# EAGLE design m201-stereo-input (EAGLE 7.5.1)
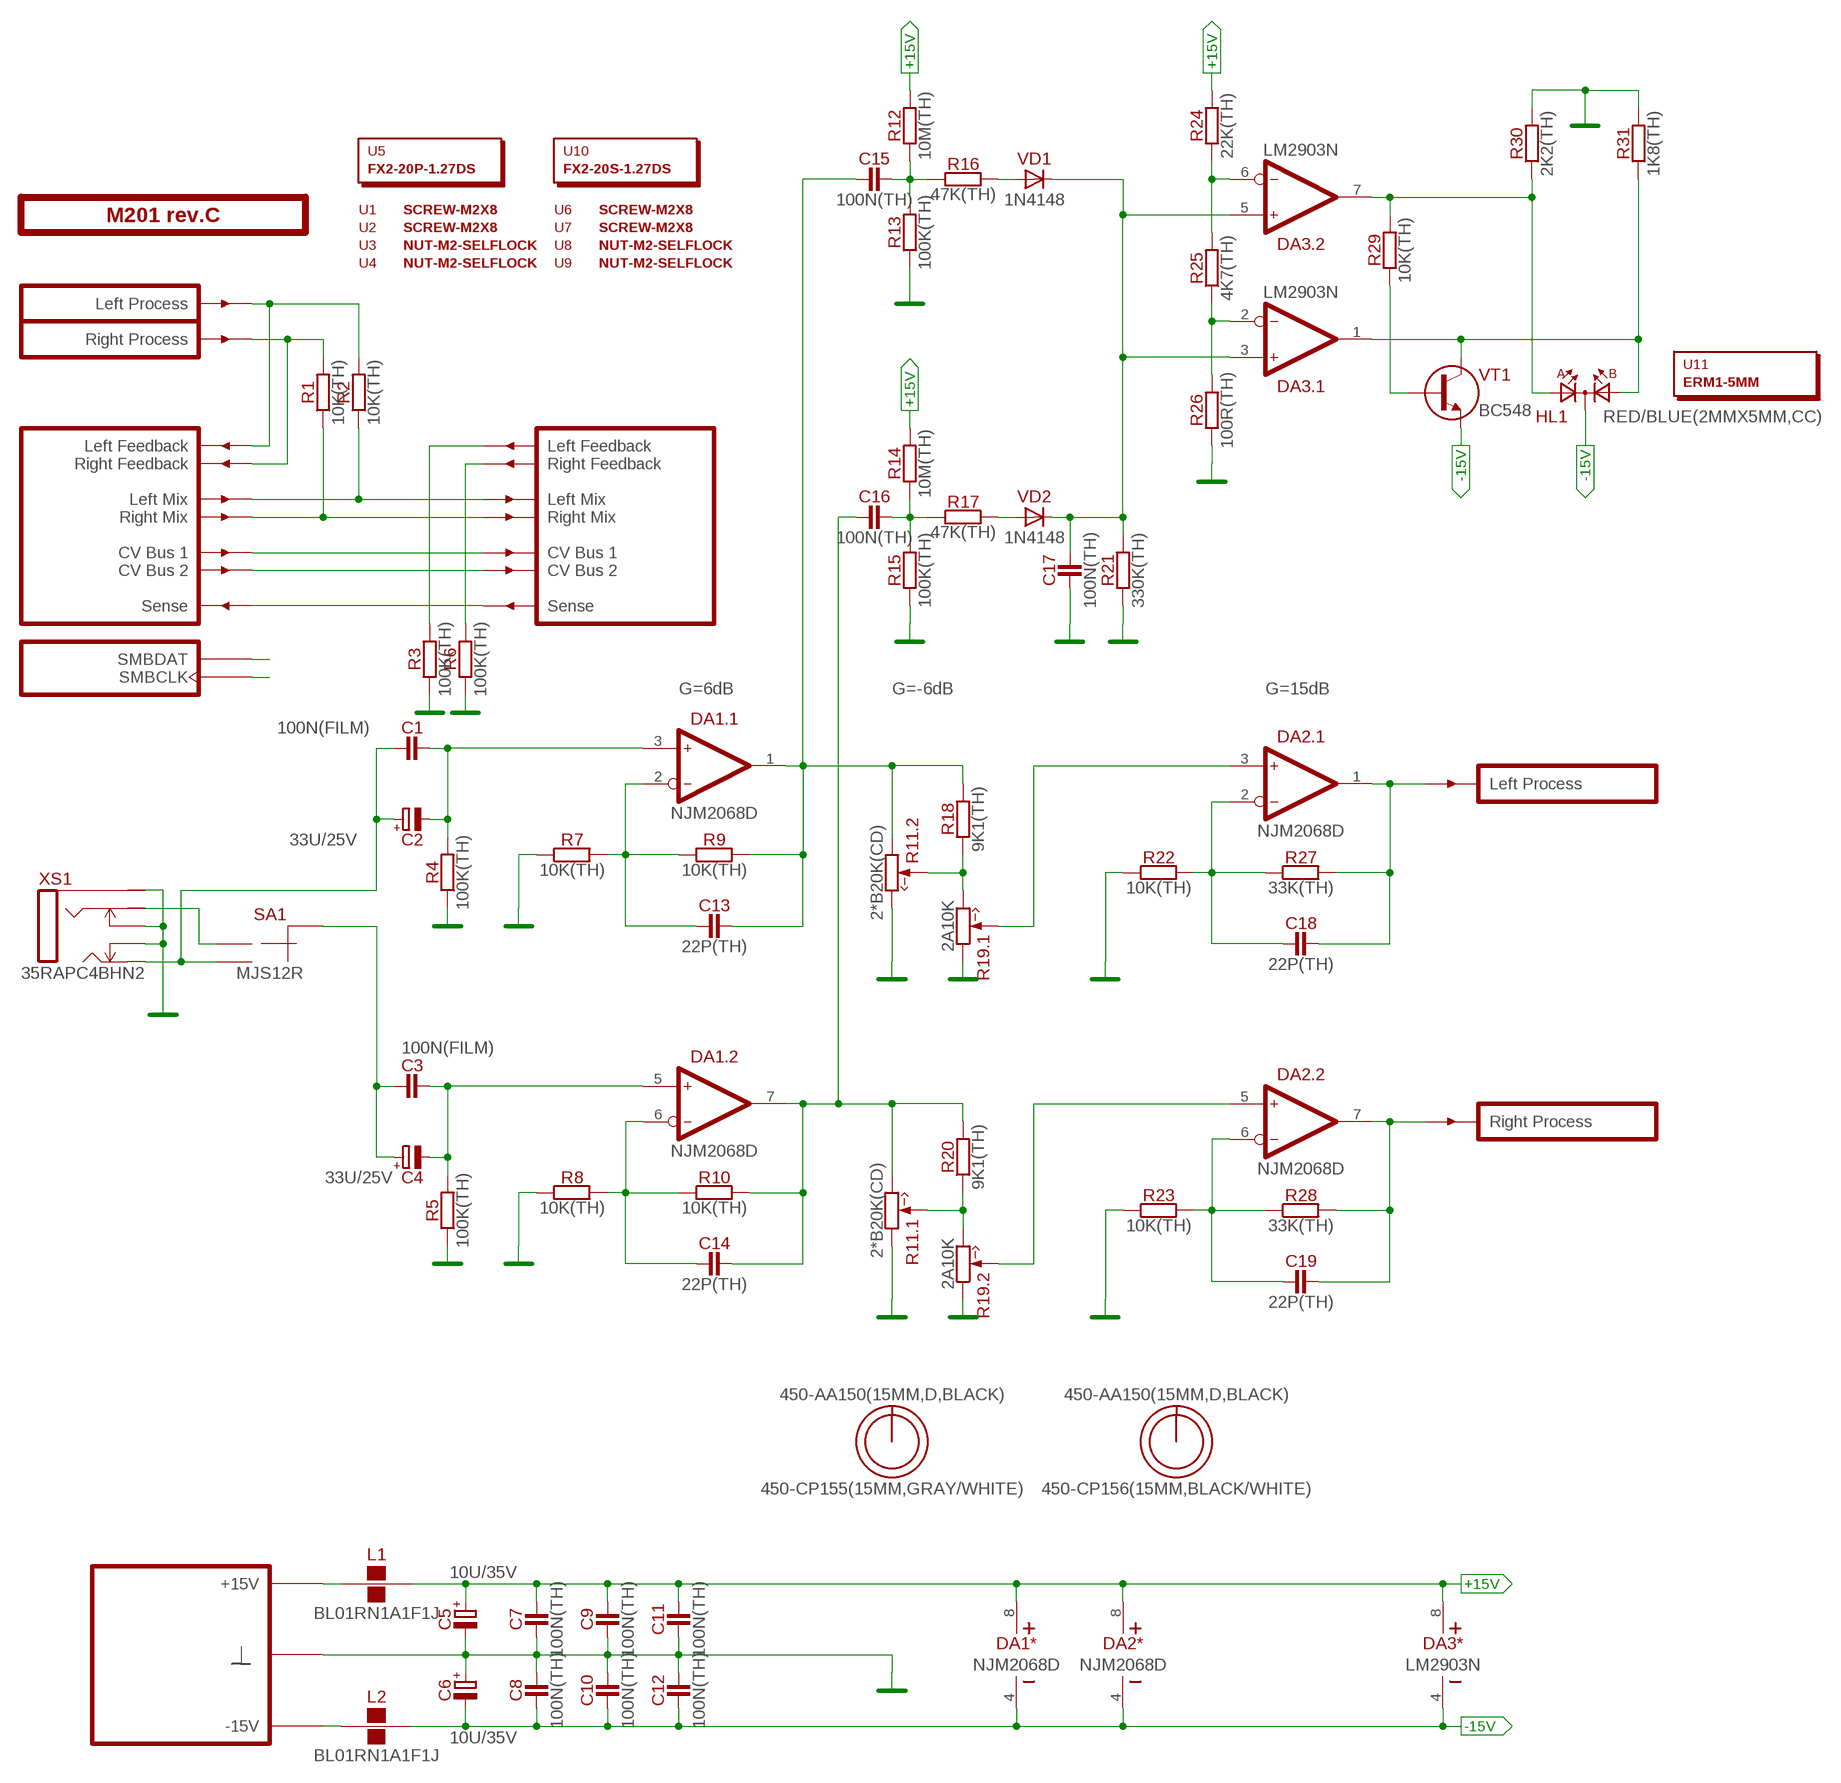
[diagram p0: schematic, sheet 1]

## Parts
C1  100N(FILM)  [C050-025X075]
C2  33U/25V  [E2,5-7]
C3  100N(FILM)  [C050-025X075]
C4  33U/25V  [E2,5-7]
C5  10U/35V  [E2-5]
C6  10U/35V  [E2-5]
C7  100N(TH)  [C050-024X044]
C8  100N(TH)  [C050-024X044]
C9  100N(TH)  [C050-024X044]
C10  100N(TH)  [C050-024X044]
C11  100N(TH)  [C050-024X044]
C12  100N(TH)  [C050-024X044]
C13  22P(TH)  [C050-024X044]
C14  22P(TH)  [C050-024X044]
C15  100N(TH)  [C050-024X044]
C16  100N(TH)  [C050-024X044]
C17  100N(TH)  [C050-024X044]
C18  22P(TH)  [C050-024X044]
C19  22P(TH)  [C050-024X044]
DA1  NJM2068D  [DIP-8]
DA2  NJM2068D  [DIP-8]
DA3  LM2903N  [DIP-8]
HL1  RED/BLUE(2MMX5MM,CC)  [LED2X5-3PIN]
L1  BL01RN1A1F1J  [BL01RN1A]
L2  BL01RN1A1F1J  [BL01RN1A]
O1  450-AA150(15MM,D,BLACK)  [EMPTY]
O2  450-CP155(15MM,GRAY/WHITE)  [EMPTY]
O3  450-AA150(15MM,D,BLACK)  [EMPTY]
O4  450-CP156(15MM,BLACK/WHITE)  [EMPTY]
PCB1  M201 rev.C  ST2-BOARD-50  [ST2-BOARD-50]
R1  10K(TH)  [R-0207/10]
R2  10K(TH)  [R-0207/10]
R3  100K(TH)  [R-0207/10]
R4  100K(TH)  [R-0207/10]
R5  100K(TH)  [R-0207/10]
R6  100K(TH)  [R-0207/10]
R7  10K(TH)  [R-0207/10]
R8  10K(TH)  [R-0207/10]
R9  10K(TH)  [R-0207/10]
R10  10K(TH)  [R-0207/10]
R11  2*B20K(CD)  2B20K(CD)  [RV11-DUAL]
R12  10M(TH)  [R-0207/10]
R13  100K(TH)  [R-0207/10]
R14  10M(TH)  [R-0207/10]
R15  100K(TH)  [R-0207/10]
R16  47K(TH)  [R-0207/10]
R17  47K(TH)  [R-0207/10]
R18  9K1(TH)  [R-0207/10]
R19  2A10K  [RV11-DUAL]
R20  9K1(TH)  [R-0207/10]
R21  330K(TH)  [R-0207/10]
R22  10K(TH)  [R-0207/10]
R23  10K(TH)  [R-0207/10]
R24  22K(TH)  [R-0207/10]
R25  4K7(TH)  [R-0207/10]
R26  100R(TH)  [R-0207/10]
R27  33K(TH)  [R-0207/10]
R28  33K(TH)  [R-0207/10]
R29  10K(TH)  [R-0207/10]
R30  2K2(TH)  [R-0207/10]
R31  1K8(TH)  [R-0207/10]
SA1  MJS12R  [APEM-MJS12R]
U1  SCREW-M2X8  [EMPTY]
U2  SCREW-M2X8  [EMPTY]
U3  NUT-M2-SELFLOCK  [EMPTY]
U4  NUT-M2-SELFLOCK  [EMPTY]
U5  FX2-20P-1.27DS  [EMPTY]
U6  SCREW-M2X8  [EMPTY]
U7  SCREW-M2X8  [EMPTY]
U8  NUT-M2-SELFLOCK  [EMPTY]
U9  NUT-M2-SELFLOCK  [EMPTY]
U10  FX2-20S-1.27DS  [EMPTY]
U11  ERM1-5MM  [EMPTY]
VD1  1N4148  [DO35-7]
VD2  1N4148  [DO35-7]
VT1  BC548  [TO92]
XS1  35RAPC4BHN2  [35RAP]

## Nets
+15V [power]: C5.+ C7.2 C9.2 C11.2 DA1.8(*:V+) DA2.8(*:V+) DA3.8(*:V+) L1.2 R12.2 R14.2 R24.2
-15V: C6.- C8.1 C10.1 C12.1 DA1.4(*:V-) DA2.4(*:V-) DA3.4(*:V-) HL1.K L2.2 VT1.3(E)
GND: C5.- C6.+ C7.1 C8.2 C9.1 C10.2 C11.1 C12.2 C17.1 PCB1.B4'(GND) PCB1.B4(GND) PCB1.B5'(GND) PCB1.B5(GND) PCB1.B6'(GND) PCB1.B6(GND) PCB1.B7'(GND) PCB1.B7(GND) PCB1.B8'(GND) PCB1.B8(GND) R3.1 R4.1 R5.1 R6.1 R7.1 R8.1 R11.1(.1:CCW) R11.3'(.2:CW) R13.1 R15.1 R19.1'(.2:CCW) R19.1(.1:CCW) R21.1 R22.1 R23.1 R26.1 R30.2 R31.2 XS1.1(S) XS1.10(TN) XS1.11(RN)
LMIX: PCB1.ALMIX'(LMIX') PCB1.ALMIX(LMIX) R2.1
N$1: L1.1 PCB1.A+15'(P+15V) PCB1.A+15(P+15V) PCB1.B+15'(P+15V) PCB1.B+15(P+15V)
N$2: PCB1.ARFBK'(RFBK') R6.2
N$3: DA2.3(.1:IN+) R19.2(.1:W)
N$4: PCB1.ALFBK'(LFBK') R3.2
N$5: L2.1 PCB1.A-15'(P-15V) PCB1.A-15(P-15V) PCB1.B-15'(P-15V) PCB1.B-15(P-15V)
N$6: SA1.NC XS1.3(R)
N$7: C1.1 C2.+ SA1.NO XS1.2(T)
N$8: DA2.5(.2:IN+) R19.2'(.2:W)
N$9: C3.2 C4.- DA1.5(.2:IN+) R5.2
N$10: C1.2 C2.- DA1.3(.1:IN+) R4.2
N$11: C19.2 DA2.7(.2:OUT) PCB1.BOUTR'(OUTR) R28.2
N$12: C18.2 DA2.1(.1:OUT) PCB1.BOUTL'(OUTL) R27.2
N$13: C18.1 DA2.2(.1:IN-) R22.2 R27.1
N$14: C19.1 DA2.6(.2:IN-) R23.2 R28.1
N$15: C14.2 C16.1 DA1.7(.2:OUT) R10.2 R11.3(.1:CW) R20.2
N$16: PCB1.BSENSE'(SENSE') PCB1.BSENSE(SENSE)
N$17: C15.2 R12.1 R13.2 R16.1
N$19: C13.2 C15.1 DA1.1(.1:OUT) R9.2 R11.1'(.2:CCW) R18.2
N$26: C13.1 DA1.2(.1:IN-) R7.2 R9.1
N$27: C14.1 DA1.6(.2:IN-) R8.2 R10.1
N$29: R16.2 VD1.A
N$30: R11.2'(.2:W) R18.1 R19.3(.1:CW)
N$31: C16.2 R14.1 R15.2 R17.1
N$32: R11.2(.1:W) R19.3'(.2:CW) R20.1
N$36: C3.1 C4.+ SA1.C(CM)
N$38: PCB1.ASMBDAT'(SMBDAT) PCB1.ASMBDAT(SMBDAT)
N$39: PCB1.ARFBK(RFBK) PCB1.BINR(INR) R1.2
N$40: PCB1.ALFBK(LFBK) PCB1.BINL(INL) R2.2
N$41: PCB1.ACV1'(CV1') PCB1.ACV1(CV1)
N$42: PCB1.ACV2'(CV2') PCB1.ACV2(CV2)
N$43: PCB1.ASMBCLK'(SMBCLK) PCB1.ASMBCLK(SMBCLK)
N$44: R17.2 VD2.A
N$45: C17.2 DA3.3(.1:IN+) DA3.5(.2:IN+) R21.2 VD1.C VD2.C
N$46: DA3.2(.1:IN-) R25.1 R26.2
N$47: DA3.6(.2:IN-) R24.1 R25.2
N$48: DA3.7(.2:OUT) HL1.A1 R29.2 R30.1
N$49: R29.1 VT1.2(B)
N$51: DA3.1(.1:OUT) HL1.A2 R31.1 VT1.1(C)
RMIX: PCB1.ARMIX'(RMIX') PCB1.ARMIX(RMIX) R1.1

## Notes on the sheet
- G=6dB | G=-6dB | G=15dB

## Library data of the parts
C1 C3 = capacitors:?; MOUSER: 505-MKS2.1/63/5
C2 C4 = capacitors-electrolytic:?
C5 C6 = capacitors-electrolytic:?; MOUSER: 647-USW1V100MDD
C7-C12 C15-C17 = capacitors:?; MOUSER: 81-RCER71H104K0A2H3B
C13 C14 C18 C19 = capacitors:?
DA1 DA2 = ic-jrc:NJM2068; MOUSER: 513-NJM2068D
DA3 = ic-fairchild:LM2903; MOUSER: 512-LM2903N
HL1 = optoelectronics:?(2MMX5MM,CC)
L1 L2 = inductors:BL01RN1A?; MOUSER: 81-BL01RN1A1F1J
O1 O3 = hardware:450-AA?; MOUSER: 450-AA150
O2 = hardware:450-C?; MOUSER: 450-CP155
O4 = hardware:450-C?; MOUSER: 450-CP156
PCB1 = module-footprints:ST2-BOARD-?
R1 R2 R7-R10 R22 R23 R29 = resistors:?; MOUSER: 71-RN55D-F-10K
R3-R6 R13 R15 = resistors:?; MOUSER: 71-RN55D-F-100K
R11 = potentiometers:2**?; MOUSER: 688-RK12L1230C1M
R12 R14 R16-R18 R20 R21 R25 R27 R28 R30 R31 = resistors:?
R19 = potentiometers:2**?; MOUSER: 688-RK12L12C0A0E
R24 = resistors:?; MOUSER: 71-CCF0722K0GKE36
R26 = resistors:?; MOUSER: 71-RN55D-F-100/R
SA1 = switches:MJS12R; MOUSER: 642-MJS12R
U1-U4 U6-U9 = hardware:*?
U5 = hardware:?; MOUSER: 798-FX2-20P-1.27DS71
U10 = hardware:?; MOUSER: 798-FX2-20S-1.27DS71
U11 = hardware:?
VD1 VD2 = diodes:?; MOUSER: 583-1N4148-T
VT1 = transistors-npn:?
XS1 = connectors:35RAPC4BHN2; MOUSER: 502-35RAPC4BHN2

## Board
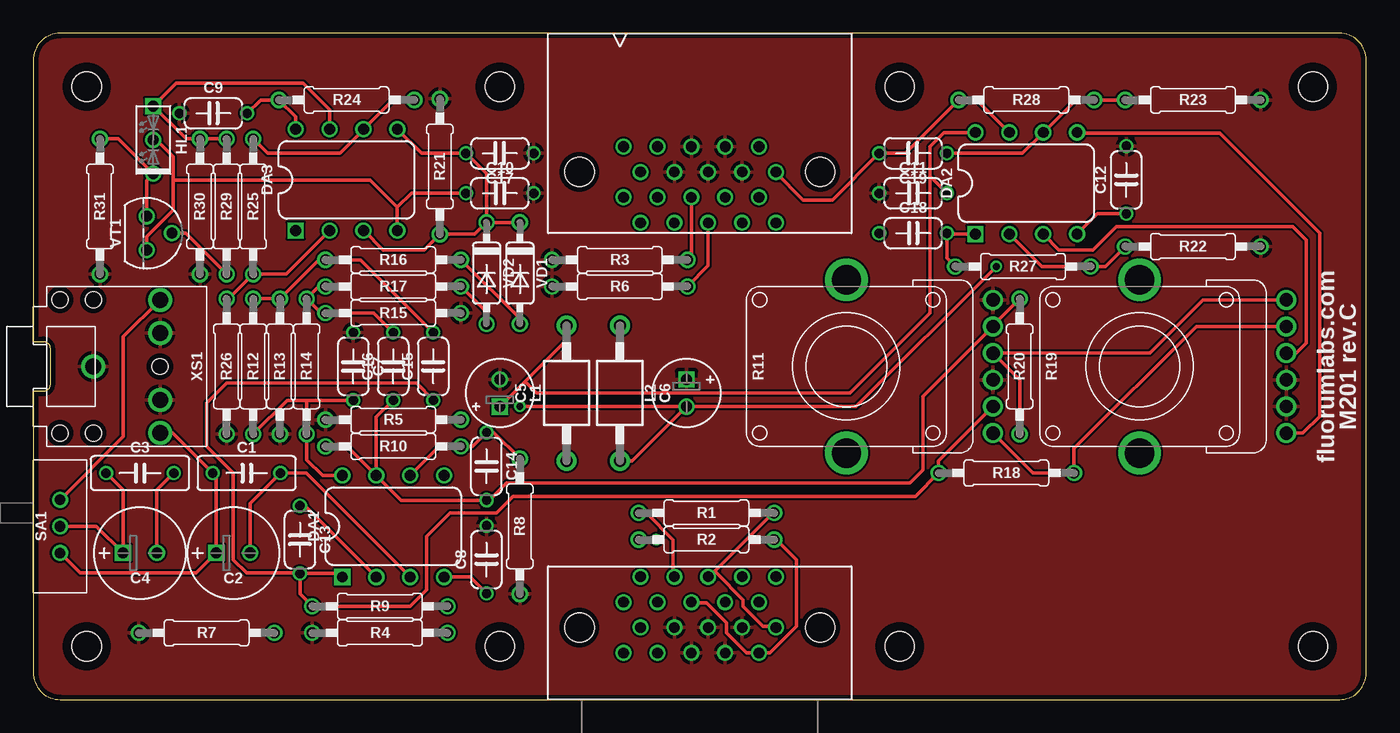
[diagram p1: board, top side]
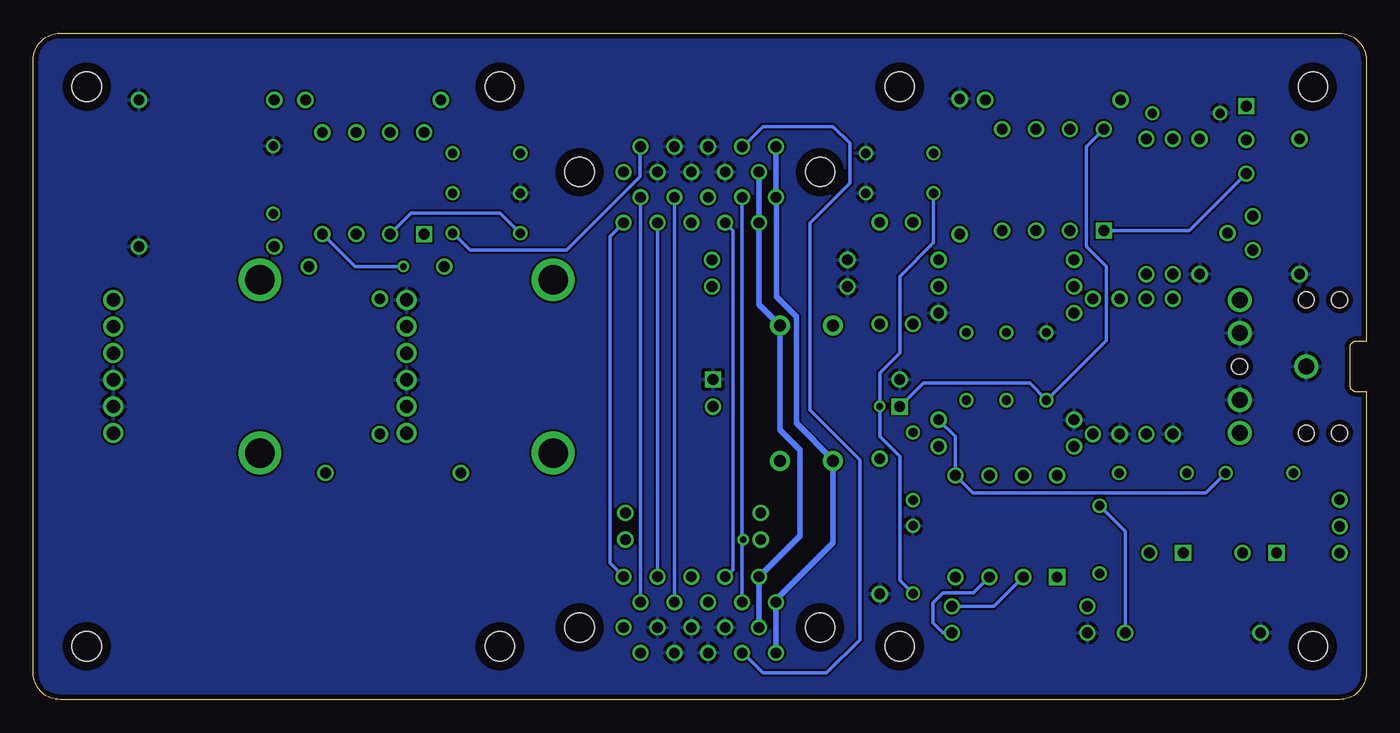
[diagram p2: board, bottom side, seen from below]

Size 100 x 50 mm. Coordinates in mm from the lower left corner, seen from the top.
Outline: 0,48 0,26.88 0.75,26.88 arc-90 1.25,26.38 1.25,23.62 arc-90 0.75,23.12 0,23.12 0,2 arc90 2,0 98,0 arc90 100,2 100,48 arc90 98,50 2,50 arc90 0,48
Copper layers (1*16): Top 0.0356mm / dielectric 1.5011mm / Bottom 0.0356mm
Design rules "LaenPCBOrder": minimum track width 6mil, minimum drill 13mil, track to track 6mil, track to pad 6mil, pad to pad 6mil, via to via 6mil, smd to smd 6mil, copper to edge 15mil, drill to drill 6mil, minimum pad ring 7mil, minimum via ring 7mil, stop-mask expansion 3mil, vias tented up to drill 0mil, thermal gap 10mil

### Footprints (pad centres in the part's own frame; a part is rotated, then mirrored left to right if it is on the bottom)
C050-025X075 = drill 0.7: 1 -2.54,0; 2 2.54,0
E2,5-7 = drill 0.813 square: + -1.27,0 | drill 0.813: - 1.27,0
E2-5 = drill 0.813 square: + -1.016,0 | drill 0.813: - 1.016,0
C050-024X044 = drill 0.7: 1 -2.54,0; 2 2.54,0
DIP-8 = drill 0.813 square: 1 -3.81,-3.81 | drill 0.813: 2 -1.27,-3.81; 3 1.27,-3.81; 4 3.81,-3.81; 5 3.81,3.81; 6 1.27,3.81; 7 -1.27,3.81; 8 -3.81,3.81
LED2X5-3PIN = drill 0.813 square: A1 -2.54,0 | drill 0.813: A2 2.54,0; K 0,0
BL01RN1A = drill 0.9 pad 1.5: 1 -5.08,0; 2 5.08,0
ST2-BOARD-50 = drill 0.8: A+15 44.285,7.31; A+15' 44.285,37.69; A-15 45.555,9.215; A-15' 45.555,35.785; ACV1 51.905,7.31; ACV1' 51.905,37.69; ACV2 53.175,9.215; ACV2' 53.175,35.785; ALFBK 49.365,7.31; ALFBK' 49.365,37.69; ALMIX 46.825,7.31; ALMIX' 46.825,37.69; ARFBK 50.635,9.215; ARFBK' 50.635,35.785; ARMIX 48.095,9.215; ARMIX' 48.095,35.785; ASMBCLK 55.715,9.215; ASMBCLK' 55.715,35.785; ASMBDAT 54.445,7.31; ASMBDAT' 54.445,37.69; B4 48.095,5.405; B4' 48.095,39.595; B5 49.365,3.5; B5' 49.365,41.5; B6 50.635,5.405; B6' 50.635,39.595; B7 51.905,3.5; B7' 51.905,41.5; B8 53.175,5.405; B8' 53.175,39.595; B+15 44.285,3.5; B+15' 44.285,41.5; B-15 45.555,5.405; B-15' 45.555,39.595; BINL 54.445,3.5; BINR 55.715,5.405; BOUTL' 54.445,41.5; BOUTR' 55.715,39.595; BSENSE 46.825,3.5; BSENSE' 46.825,41.5 | hole 2.2: 4,4; 4,46; 96,4; 96,46; 35,46; 65,46; 65,4; 35,4; 59.025,5.405; 40.975,5.405; 40.975,39.595; 59.025,39.595
R-0207/10 = drill 0.813: 1 -5.08,0; 2 5.08,0
RV11-DUAL = drill 1: 1 -1,-11; 1' -3,-11; 2 1,-11; 2' -5,-11; 3 3,-11; 3' 5,-11 | drill 2.2: S1 -6.5,0; S2 6.5,0
APEM-MJS12R = drill 0.8: C 0,-2; NC 2,-2; NO -2,-2
DO35-7 = drill 0.813: A 3.81,0; C -3.81,0
TO92 = drill 0.813: 1 -1.27,0; 2 0,1.905; 3 1.27,0
35RAP = drill 1.2: 1 4.5,0; 2 9.5,-5; 3 9.5,5; 10 9.5,-2.5; 11 9.5,2.5 | hole 1.2: 2,5; 2,-5; 4.5,5; 4.5,-5; 9.5,0

### Placement (x,y rotation side)
C1  16,17 0 top
C2  15,11 0 top
C3  8,17 0 top
C4  8,11 0 top
C5  35,23 90 top
C6  49,23 270 top
C7  24,25 270 top
C8  34,10.5 90 top
C9  13.5,44 0 top
C10  35,38 0 top
C11  66,38 0 top
C12  82,39 90 top
C13  20,12 270 top
C14  34,17.5 270 top
C15  30,25 90 top
C16  27,25 90 top
C17  35,41 180 top
C18  66,35 0 top
C19  66,41 180 top
DA1  27,13 0 top
DA2  74.5,38.75 0 top
DA3  23.5,39 0 top
HL1  9,42 270 top
L1  40,23 90 top
L2  44,23 270 top
O1  74.5,-100.5 0 top  (outside the outline)
O2  76.75,-100.5 0 top  (outside the outline)
O3  79,-100.5 0 top  (outside the outline)
O4  81.25,-100.5 0 top  (outside the outline)
PCB1  0,0 0 top
R1  50.5,14 0 top
R2  50.5,12 0 top
R3  44,33 0 top
R4  26,5 0 top
R5  27,21 0 top
R6  44,31 0 top
R7  13,5 0 top
R8  36.5,13 90 top
R9  26,7 180 top
R10  27,19 180 top
R11  61,25 90 top
R12  16.5,25 270 top
R13  18.5,25 90 top
R14  20.5,25 270 top
R15  27,29 180 top
R16  27,33 0 top
R17  27,31 0 top
R18  73,17 180 top
R19  2*A10K  [RV11-DUAL]  83,25 90 top
R20  74,25 90 top
R21  30.5,40 270 top
R22  87,34 180 top
R23  87,45 180 top
R24  23.5,45 180 top
R25  16.5,37 90 top
R26  14.5,25 90 top
R27  74.25,32.5 180 top
R28  74.5,45 180 top
R29  14.5,37 90 top
R30  12.5,37 270 top
R31  5,37 270 top
SA1  0,13 90 top
U1  90.25,-100.5 0 top  (outside the outline)
U2  92.5,-100.5 0 top  (outside the outline)
U3  94.75,-100.5 0 top  (outside the outline)
U4  1,-102.75 0 top  (outside the outline)
U5  83.5,-100.5 0 top  (outside the outline)
U6  3.25,-102.75 0 top  (outside the outline)
U7  5.5,-102.75 0 top  (outside the outline)
U8  7.75,-102.75 0 top  (outside the outline)
U9  10,-102.75 0 top  (outside the outline)
U10  85.75,-100.5 0 top  (outside the outline)
U11  88,-100.5 0 top  (outside the outline)
VD1  36.5,32 270 top
VD2  34,32 270 top
VT1  8.5,35 270 top
XS1  0,25 0 top

### Tracks (layer width: path | path; a pad name or v marks a point on that pad's centre or on a via)
+15V
  Top 0.254: DA1.8 21.69,16.81 20.5,18 R14.2 20.5,22.46 | C7.2 20.5,22.46 | 20.5,22.46 19.04,22.46 R12.2 | DA3.8 19.69,43.73 R24.2 17.04,45 C9.2 | DA2.8 68.31,42.56 67.25,41.5 67.25,39.29 | 67.25,39.29 C11.2 | C5.+ 35,22 36.88,23.88 | 36.88,23.88 40,27 L1.2 | 67.25,39.29 67.25,29 61.25,23 37.75,23 36.88,23.88
  Bottom 0.254: DA3.8 21,41.5 21,34 19.5,32.5 19.5,26.96 C7.2 24,22.5 25.25,23.75 33.23,23.75 C5.+
-15V  (via drill 0.5)
  Top 0.254: DA1.4 32.77,9.19 C8.1 | HL1.K 9.25,42 10.5,40.75 10.5,39 | 10.5,39 10.5,36.75 8.5,34.75 VT1.3 | DA3.4 27.31,36.94 | 27.31,36.94 25.25,39 10.5,39 | C10.1 28.37,38 27.31,36.94 | L2.2 44.94,17.92 C6.- | C12.1 79.83,36.46 DA2.4 | C6.- 61.73,21.98 v72.25,32.5 | C6.- 36.52,21.98 v36.5,22
  Bottom 0.254: v72.25,32.5 75.87,32.5 DA2.4 | C10.1 32.46,34.29 35,31.75 35,26 36.5,24.5 v36.5,22 36.5,19.75 35,18.25 35,8.96 C8.1
GND
  pour Bottom: 0,50 100,50 100,0 0,0
  pour Top: 0,50 100,50 100,0 0,0
LMIX  (via drill 0.5)
  Top 0.254: v46.75,12 R2.1
  Bottom 0.254: PCB1.ALMIX 46.83,12 | 46.83,12 PCB1.ALMIX' | v46.75,12 46.83,12
N$1
  Bottom 0.406: PCB1.B+15 PCB1.A+15 44.28,7.46 40,11.75 L1.1 40,18 42.75,20.75 42.75,28.75 44.25,30.25 44.25,37.66 PCB1.A+15' PCB1.B+15'
N$2
  Top 0.254: PCB1.ARFBK' 50.63,32.55 R6.2
N$3
  Top 0.254: R19.2 94.75,26 95.5,26.75 95.5,34.5 94.5,35.5 81.25,35.5 79.5,33.75 76.96,33.75 DA2.3
N$4
  Top 0.254: PCB1.ALFBK' 49.37,33.28 R3.2
N$5
  Bottom 0.406: PCB1.B-15' PCB1.A-15' 45.55,29.64 L2.1 44,20.25 42.5,18.75 42.5,12.27 PCB1.A-15 PCB1.B-15
N$6
  Top 0.254: SA1.NC 6.75,19.75 6.75,27.25 XS1.3
N$7
  Top 0.254: XS1.2 10.46,20 C1.1 13.73,16.73 C2.+ 12.23,9.5 3.5,9.5 SA1.NO
N$8
  Top 0.254: R19.2' 95.25,20 96.5,21.25 96.5,35 89,42.5 78.37,42.5 DA2.5
N$9
  Top 0.254: C4.- 9.27,15.73 C3.2
  Bottom 0.254: R5.2 30.81,19.73 DA1.5 29.5,15.5 12.04,15.5 C3.2
N$10
  Top 0.254: C2.- 16.27,14.73 C1.2 20.46,17 DA1.3
  Bottom 0.254: R4.2 31.75,5 32.5,5.75 32.5,7.25 31.75,8 29.46,8 DA1.3
N$11
  Top 0.254: DA2.7 70.79,45 R28.2 65.42,41 C19.2 59.96,37.5 57.75,37.5 55.72,39.53 PCB1.BOUTR'
N$12
  Top 0.254: DA2.1 68.6,34.94 C18.2 68.54,33.13 R27.2
  Bottom 0.254: C18.2 68.5,35 67.25,33.75 60,33.75 54.5,39.25 54.5,41.45 PCB1.BOUTL'
N$13
  Top 0.254: DA2.2 75.67,32.5 R27.1 80.42,32.5 R22.2
  Bottom 0.254: C18.1 63.5,35 65,36.5 71.67,36.5 DA2.2
N$14
  Top 0.254: C19.1 74.21,41 DA2.6 78.21,45 R28.1 R23.2
N$15
  Top 0.254: R10.2 23.54,19 DA1.7 | DA1.7 27.58,14.96 C14.2 34.21,14.96 35.5,16.25 65.75,16.25 66.75,17.25 66.75,22.75 R11.3 72,28.08 R20.2 | DA1.7 25.73,21.19 C16.1
N$16
  Bottom 0.254: PCB1.BSENSE 46.75,3.5 45.25,2 40.5,2 38,4.5 38,18 41.75,21.75 41.75,35.75 38.75,38.75 38.75,41.75 40,43 45.25,43 46.75,41.5 PCB1.BSENSE'
N$17
  Top 0.254: R12.1 R13.2 21.42,33 R16.1 24.54,33 C15.2
N$19
  Top 0.254: C13.2 22.92,9.46 DA1.1 | R11.1' 67.92,17.92 R18.2 66.17,15.25 36,15.25 34.75,14 31.25,14 29.5,12.25 29.5,8.25 28.25,7 R9.2 20,7.92 C13.2 | C15.1 30,22.5 28.75,23.75 14.5,23.75 13,22.25 13,19 15,17 15,10.5 16,9.5 19.96,9.5 C13.2
N$26
  Top 0.254: C13.1 20.38,14.54 DA1.2
  Bottom 0.254: R9.1 27.92,7 DA1.2 | R7.2 18.08,12.62 C13.1
N$27
  Top 0.254: DA1.6 30.46,19 R10.1 32.96,19 C14.1 34.54,20.04 R8.2
N$29
  Top 0.254: VD1.A 36.5,28.58 R16.2
N$30
  Top 0.254: R11.2' 75,17 R18.1 78.08,18.83 87.25,28 R19.3
N$31
  Top 0.254: R17.1 21.42,31 R14.1 21.58,29 R15.2 25.54,29 C16.2
N$32
  Top 0.254: R20.1 74,24 R11.2 83.75,26 87.75,30 R19.3'
N$36
  Top 0.254: C3.1 6.73,15.73 C4.+ 4.73,13 SA1.C
N$38
  Bottom 0.254: PCB1.ASMBDAT PCB1.ASMBDAT'
N$39
  Top 0.254: 51,9.5 55.5,14 R1.2 | 51,9.5 50.75,9.25 PCB1.ARFBK 51,9.5 | PCB1.BINR 55.5,5.5 54.75,5.5 53.25,7 53.25,7.5 51.25,9.5 51,9.5
N$40
  Top 0.254: R2.2 55.75,12 57.25,10.5 57.25,5.5 55.25,3.5 PCB1.BINL 53.5,3.5 52,5 52,5.75 50.5,7.25 49.5,7.25 PCB1.ALFBK
N$41
  Bottom 0.254: PCB1.ACV1 PCB1.ACV1'
N$42
  Bottom 0.254: PCB1.ACV2 PCB1.ACV2'
N$43
  Bottom 0.254: PCB1.ASMBCLK 56.75,10.25 56.75,34.75 PCB1.ASMBCLK'
N$44
  Top 0.254: VD2.A 34,29.08 R17.2
N$45
  Top 0.254: VD1.C VD2.C | VD2.C 33.11,34.92 R21.2 29.33,33.75 26.25,33.75 24.81,35.19 DA3.3 | DA3.5 29.12,41 C17.2 34,39.46 VD2.C
N$46
  Top 0.254: R26.2 14.66,30.08 R25.1 18.96,31.92 DA3.2
N$47
  Top 0.254: R24.1 26.96,45 DA3.6 24.77,42.77 23,41 17.58,41 R25.2
N$48
  Top 0.254: R29.2 R30.1 11.46,42.08 HL1.A1 10.71,46.25 20.25,46.25 22.23,44.27 DA3.7
N$49
  Top 0.254: VT1.2 11.42,35 R29.1
N$51
  Top 0.254: VT1.1 8.5,38.96 HL1.A2 6.38,42.08 R31.1
  Bottom 0.254: DA3.1 13.27,35.19 HL1.A2
RMIX
  Top 0.254: R1.1 46,14 48,12 48,9.25 PCB1.ARMIX
  Bottom 0.254: PCB1.ARMIX 48.03,9.21 47.5,9.75 47.5,35.19 PCB1.ARMIX'